# Altium schematic sheet Arduino FPGA Design.SchDoc
size A3
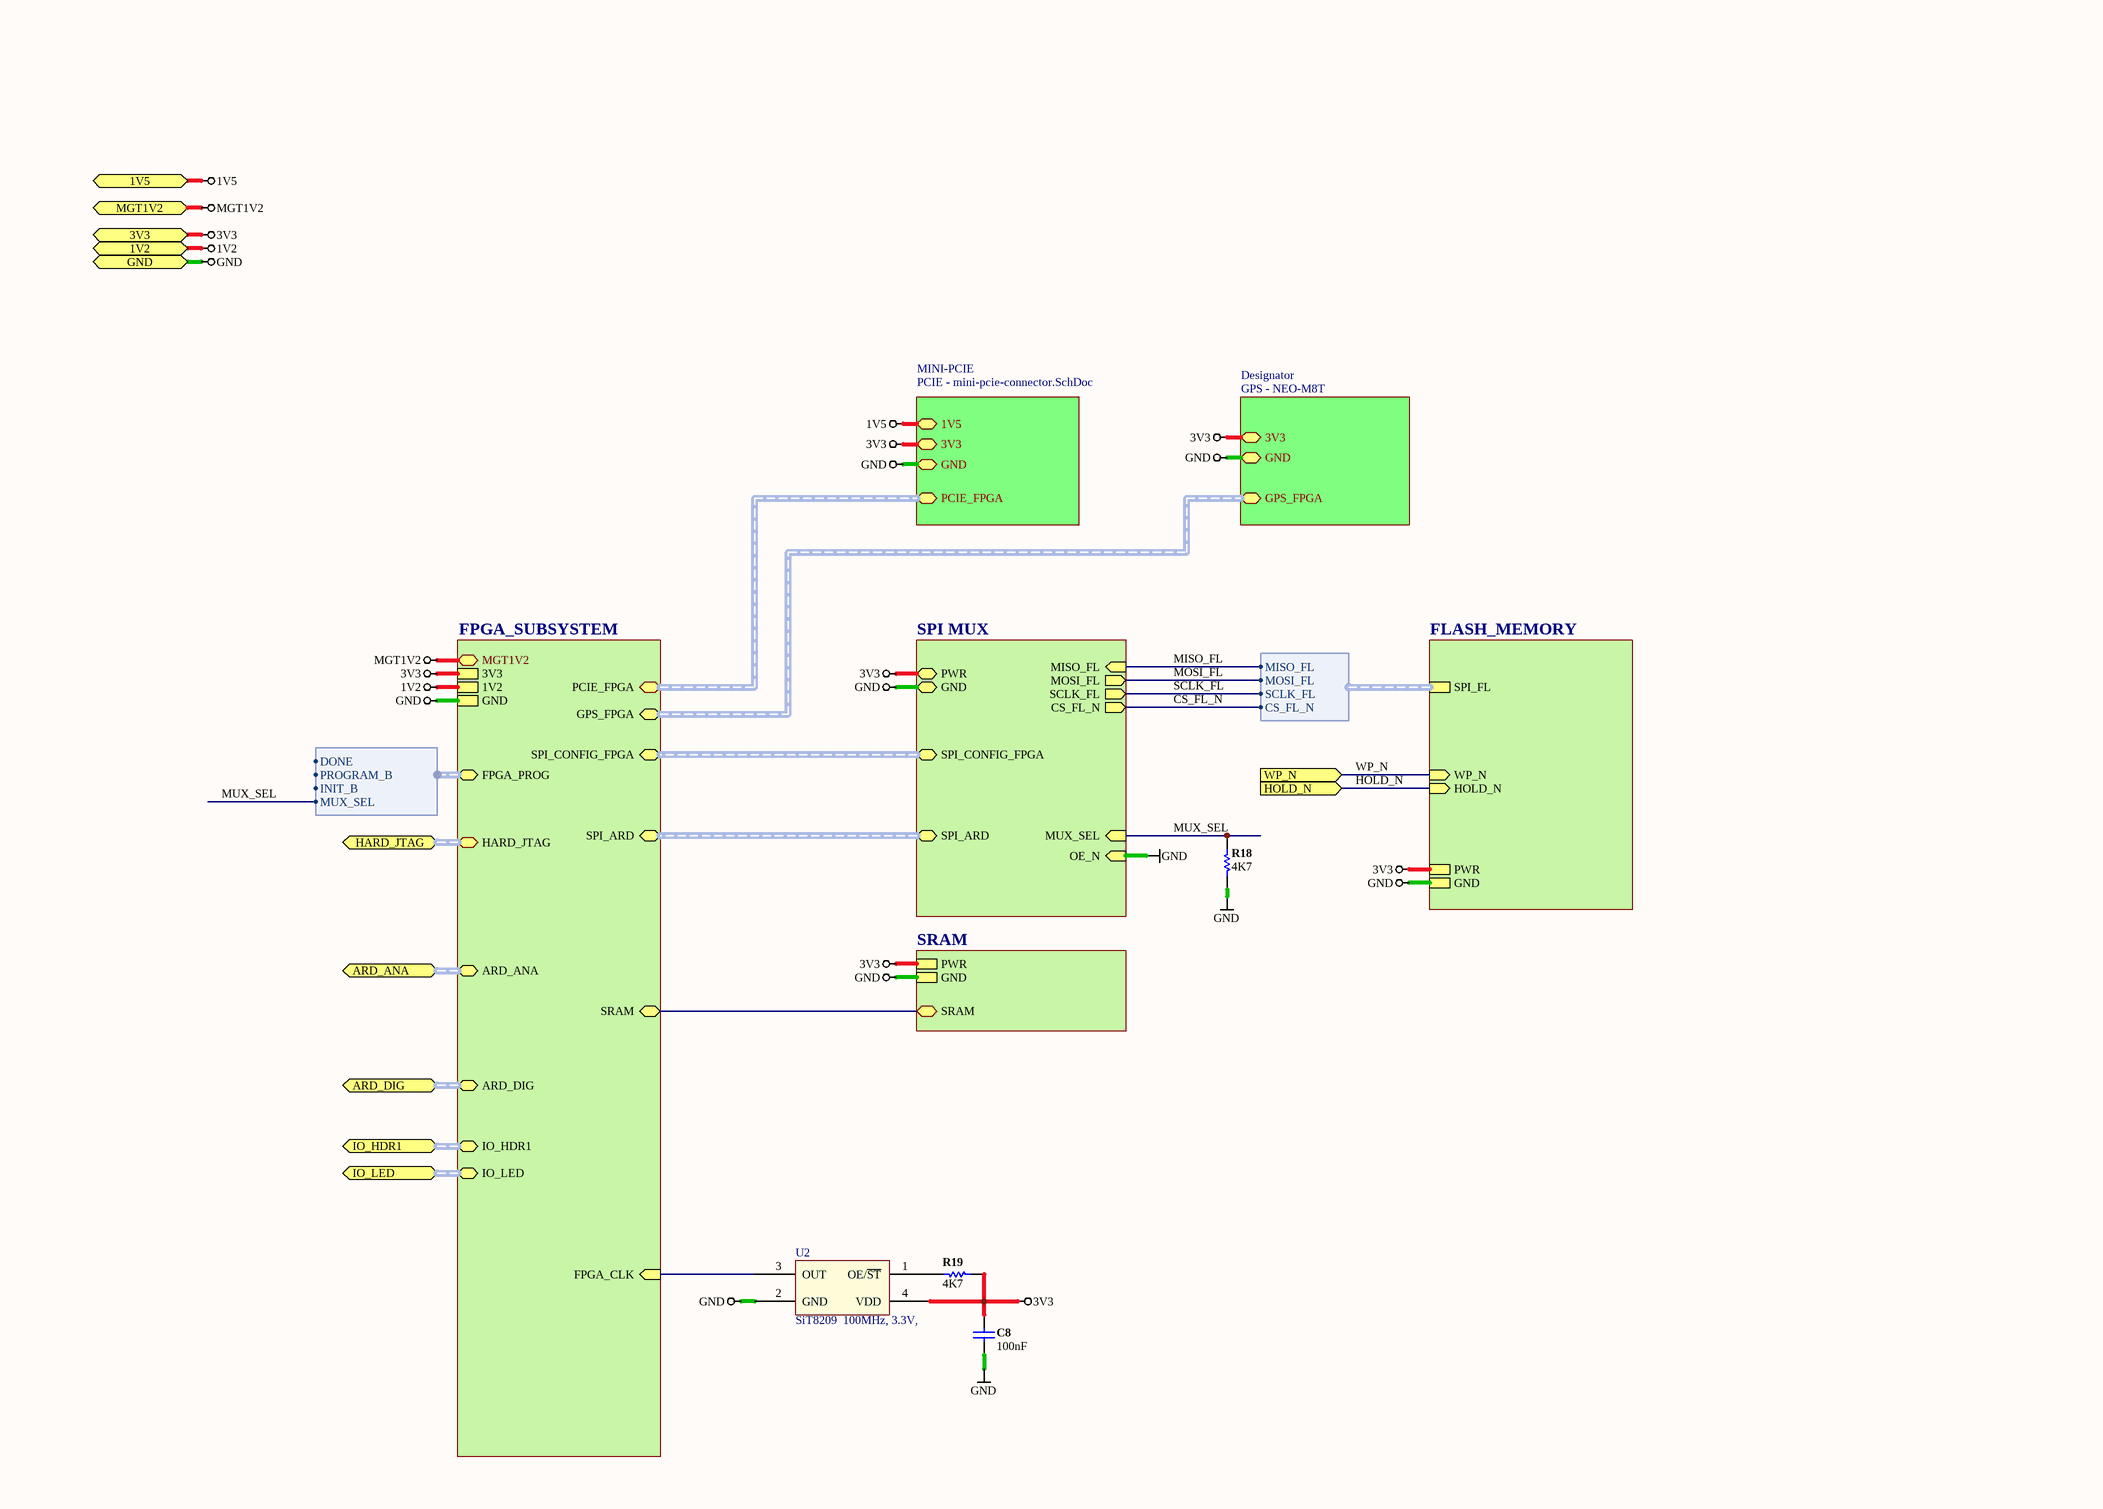
[diagram p0: Arduino FPGA Design.SchDoc]

## Parts
C8  value 100nF  [CAPC0402(1005)60_L]  (hidden comment: CAP 100nF 16V 0402(1005))
R18  value 4K7  [RESC0402(1005)40_L]  (hidden comment: 4K7 1 0402)
R19  value 4K7  [RESC0402(1005)40_L]  (hidden comment: 4K7 1 0402)
U2  SiT8209  100MHz, 3.3V,

## Sub-sheets
Designator = GPS - NEO-M8T: GPS_FPGA (harness GPS_FPGA), 3V3, GND
FLASH_MEMORY = Flash - M25P32-VMW6TG.SchDoc: SPI_FL (harness SPI_FLASH), PWR, WP_N (in), HOLD_N (in), GND
FPGA_SUBSYSTEM = FPGA - XC6SLX45T-2CSG324C.schdoc: 3V3, GND, 1V2, FPGA_CLK (in), HARD_JTAG (harness HARD_JTAG), SPI_CONFIG_FPGA (harness SPI_CONFIG_FPGA), FPGA_PROG (harness FPGA_PROGRAM), SRAM (harness SRAM), PCIE_FPGA (harness PCIE_FPGA), MGT1V2, GPS_FPGA (harness GPS_FPGA), ARD_DIG (harness ARD_DIG), ARD_ANA (harness ARD_ANA), SPI_ARD (harness SPI_ARD), IO_HDR1 (harness IO_HDR1), IO_LED (harness IO_LED)
MINI-PCIE = PCIE - mini-pcie-connector.SchDoc: PCIE_FPGA (harness PCIE_FPGA), 1V5, 3V3, GND
SPI MUX = Arduino FPGA SPI MUX.SchDoc: MISO_FL (in), MOSI_FL (out), SCLK_FL (out), CS_FL_N (out), OE_N (in), MUX_SEL (in), SPI_CONFIG_FPGA (harness SPI_CONFIG_FPGA), PWR, GND, SPI_ARD (harness SPI_ARD)
SRAM = SRAM0 - IS61WV12816DBLL-10BLI.SchDoc: PWR, GND, SRAM (harness SRAM)

## Ports
1V2, 1V5, 3V3, ARD_ANA (harness ARD_ANA), ARD_DIG (harness ARD_DIG), GND, HARD_JTAG (harness HARD_JTAG), HOLD_N (in), IO_HDR1 (harness IO_HDR1), IO_LED (harness IO_LED), MGT1V2, WP_N (in)

## Harnesses
SPI_FLASH: MOSI_FL, MISO_FL, SCLK_FL, CS_FL_N
FPGA_PROGRAM: INIT_B, PROGRAM_B, DONE, MUX_SEL

## Nets
1V2: port 1V2, sheet FPGA_SUBSYSTEM/1V2
1V5: port 1V5, sheet MINI-PCIE/1V5
3V3: C8.1 R19.2 U2.4(VDD) ; port 3V3, sheet FLASH_MEMORY/PWR, sheet FPGA_SUBSYSTEM/3V3, sheet SPI MUX/PWR, sheet SRAM/PWR, sheet MINI-PCIE/3V3, sheet Designator/3V3
GND: C8.2 R18.1 U2.2(GND) ; port GND, sheet FLASH_MEMORY/GND, sheet FPGA_SUBSYSTEM/GND, sheet SPI MUX/OE_N, sheet SPI MUX/GND, sheet SRAM/GND, sheet MINI-PCIE/GND, sheet Designator/GND
MGT1V2: port MGT1V2, sheet FPGA_SUBSYSTEM/MGT1V2
CS_FL_N: sheet SPI MUX/CS_FL_N, sheet FLASH_MEMORY/SPI_FL.CS_FL_N
HOLD_N: port HOLD_N, sheet FLASH_MEMORY/HOLD_N
MISO_FL: sheet SPI MUX/MISO_FL, sheet FLASH_MEMORY/SPI_FL.MISO_FL
MOSI_FL: sheet SPI MUX/MOSI_FL, sheet FLASH_MEMORY/SPI_FL.MOSI_FL
MUX_SEL: R18.2 ; sheet SPI MUX/MUX_SEL, sheet FPGA_SUBSYSTEM/FPGA_PROG.MUX_SEL
SCLK_FL: sheet SPI MUX/SCLK_FL, sheet FLASH_MEMORY/SPI_FL.SCLK_FL
WP_N: port WP_N, sheet FLASH_MEMORY/WP_N
NetR19_1: R19.1 U2.1(OE/~{ST})
NetU2_3: U2.3(OUT) ; sheet FPGA_SUBSYSTEM/FPGA_CLK

## Buses and harness runs
harness port ARD_ANA = sheet FPGA_SUBSYSTEM/ARD_ANA
harness port ARD_DIG = sheet FPGA_SUBSYSTEM/ARD_DIG
harness port HARD_JTAG = sheet FPGA_SUBSYSTEM/HARD_JTAG
harness port IO_HDR1 = sheet FPGA_SUBSYSTEM/IO_HDR1
harness port IO_LED = sheet FPGA_SUBSYSTEM/IO_LED
harness sheet Designator/GPS_FPGA = sheet FPGA_SUBSYSTEM/GPS_FPGA
harness sheet FPGA_SUBSYSTEM/PCIE_FPGA = sheet MINI-PCIE/PCIE_FPGA
harness sheet FPGA_SUBSYSTEM/SPI_ARD = sheet SPI MUX/SPI_ARD
harness sheet FPGA_SUBSYSTEM/SPI_CONFIG_FPGA = sheet SPI MUX/SPI_CONFIG_FPGA

## Library data of the parts
C8 = CAP 100nF 16V ±10% 0402 (1005 Metric) Thickness 0.6mm SMD: Manufacturer_PN: C0402C104K8PACTU; Case-EIA: 0402; Case-Metric: 1005; Tolerance: ±10%; Max Thickness: 0.6 mm; Rated Voltage: 16 V; Technology: SMT; Manufacturer Part Number: C0402C104K8PACTU
R18 R19 = 0402 (1005 Metric) 1/16 W 4K7 1 Thick Film Chip Resistor: Manufacturer_PN: CR0402-FX-4701GLFDKR-ND; Case-EIA: 0402; Case-Metric: 1005; Power: 1/16 W; Temp Coefficient ppm/°C: ±100; Tolerance %: 1%; Value (Ohms): 4700; Technology: SMT; Manufacturer Part Number: CR0402-FX-4701GLFDKR-ND
U2 = SiT8209